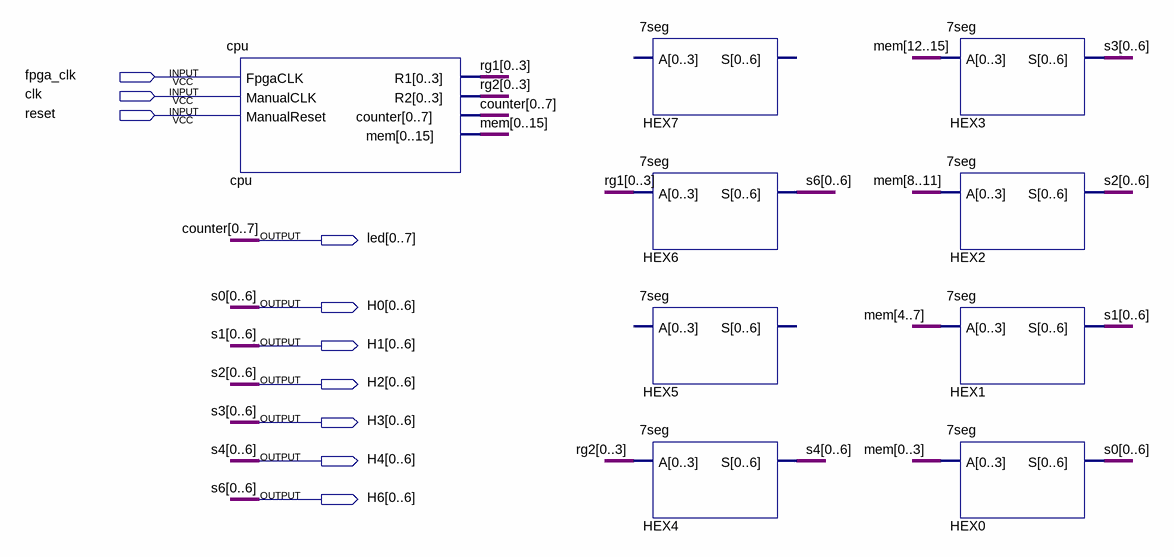
[diagram p0: schematic sheet]
// Quartus schematic fpga.bdf as structural Verilog: 9 symbols, 10 pins
module fpga (
  input  fpga_clk,
  input  clk,
  input  reset,
  output [0:7] led,
  output [0:6] H0,
  output [0:6] H1,
  output [0:6] H2,
  output [0:6] H3,
  output [0:6] H4,
  output [0:6] H6
);

  wire [3:0] rg1, rg2;
  wire [15:0] mem;

  cpu cpu (
    .FpgaCLK(fpga_clk), .ManualCLK(clk), .ManualReset(reset), .R1({rg1[0], rg1[1], rg1[2], rg1[3]}),
    .R2({rg2[0], rg2[1], rg2[2], rg2[3]}), .counter(led),
    .mem({mem[0], mem[1], mem[2], mem[3], mem[4], mem[5], mem[6], mem[7], mem[8], mem[9], mem[10], mem[11], mem[12], mem[13], mem[14], mem[15]}));
  \7seg  HEX7 ();  // open: A, S
  \7seg  HEX6 (.A({rg1[0], rg1[1], rg1[2], rg1[3]}), .S(H6));
  \7seg  HEX5 ();  // open: A, S
  \7seg  HEX4 (.A({rg2[0], rg2[1], rg2[2], rg2[3]}), .S(H4));
  \7seg  HEX3 (.A({mem[12], mem[13], mem[14], mem[15]}), .S(H3));
  \7seg  HEX2 (.A({mem[8], mem[9], mem[10], mem[11]}), .S(H2));
  \7seg  HEX1 (.A({mem[4], mem[5], mem[6], mem[7]}), .S(H1));
  \7seg  HEX0 (.A({mem[0], mem[1], mem[2], mem[3]}), .S(H0));

  // Other names for the same wires on the sheet: counter[7:0] = {led[7], led[6], led[5], led[4], led[3], led[2], led[1], led[0]};
  //   s0[6:0] = {H0[6], H0[5], H0[4], H0[3], H0[2], H0[1], H0[0]};
  //   s1[6:0] = {H1[6], H1[5], H1[4], H1[3], H1[2], H1[1], H1[0]};
  //   s2[6:0] = {H2[6], H2[5], H2[4], H2[3], H2[2], H2[1], H2[0]};
  //   s3[6:0] = {H3[6], H3[5], H3[4], H3[3], H3[2], H3[1], H3[0]};
  //   s4[6:0] = {H4[6], H4[5], H4[4], H4[3], H4[2], H4[1], H4[0]};
  //   s6[6:0] = {H6[6], H6[5], H6[4], H6[3], H6[2], H6[1], H6[0]}
endmodule
